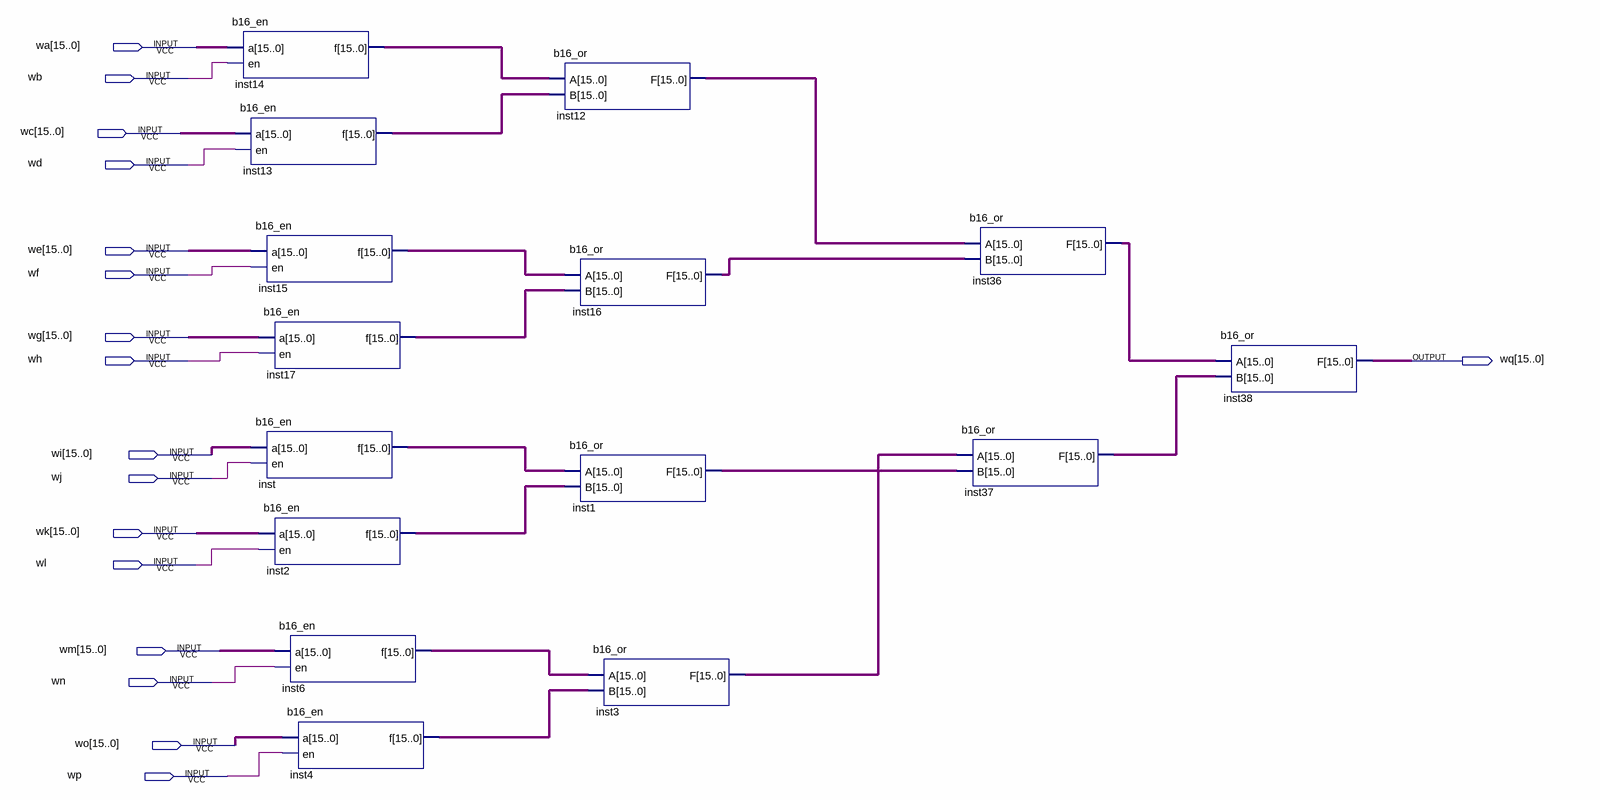
[diagram p0: schematic sheet]
// Quartus schematic multi_bus_and.bdf as structural Verilog: 15 symbols, 17 pins
module multi_bus_and (
  input  [15:0] wa,
  input  wb,
  input  [15:0] wc,
  input  wd,
  input  [15:0] we,
  input  wf,
  input  [15:0] wg,
  input  wh,
  input  [15:0] wi,
  input  wj,
  input  [15:0] wk,
  input  wl,
  input  [15:0] wm,
  input  wn,
  input  [15:0] wo,
  input  wp,
  output [15:0] wq
);

  wire [15:0] inst1_f, inst2_f, inst3_f, inst4_f, inst6_f, inst12_f, inst13_f, inst14_f, inst15_f, inst16_f,
       inst17_f, inst36_f, inst37_f, inst_f;

  b16_en inst14 (.a(wa), .en(wb), .f(inst14_f));
  b16_en inst13 (.a(wc), .en(wd), .f(inst13_f));
  b16_en inst15 (.a(we), .en(wf), .f(inst15_f));
  b16_en inst17 (.a(wg), .en(wh), .f(inst17_f));
  b16_en inst (.a(wi), .en(wj), .f(inst_f));
  b16_en inst2 (.a(wk), .en(wl), .f(inst2_f));
  b16_en inst6 (.a(wm), .en(wn), .f(inst6_f));
  b16_en inst4 (.a(wo), .en(wp), .f(inst4_f));
  b16_or inst12 (.A(inst14_f), .B(inst13_f), .F(inst12_f));
  b16_or inst16 (.A(inst15_f), .B(inst17_f), .F(inst16_f));
  b16_or inst1 (.A(inst_f), .B(inst2_f), .F(inst1_f));
  b16_or inst3 (.A(inst6_f), .B(inst4_f), .F(inst3_f));
  b16_or inst36 (.A(inst12_f), .B(inst16_f), .F(inst36_f));
  b16_or inst37 (.A(inst3_f), .B(inst1_f), .F(inst37_f));
  b16_or inst38 (.A(inst36_f), .B(inst37_f), .F(wq));
endmodule
